# EAGLE design trackoon solar (EAGLE 7.2.0)
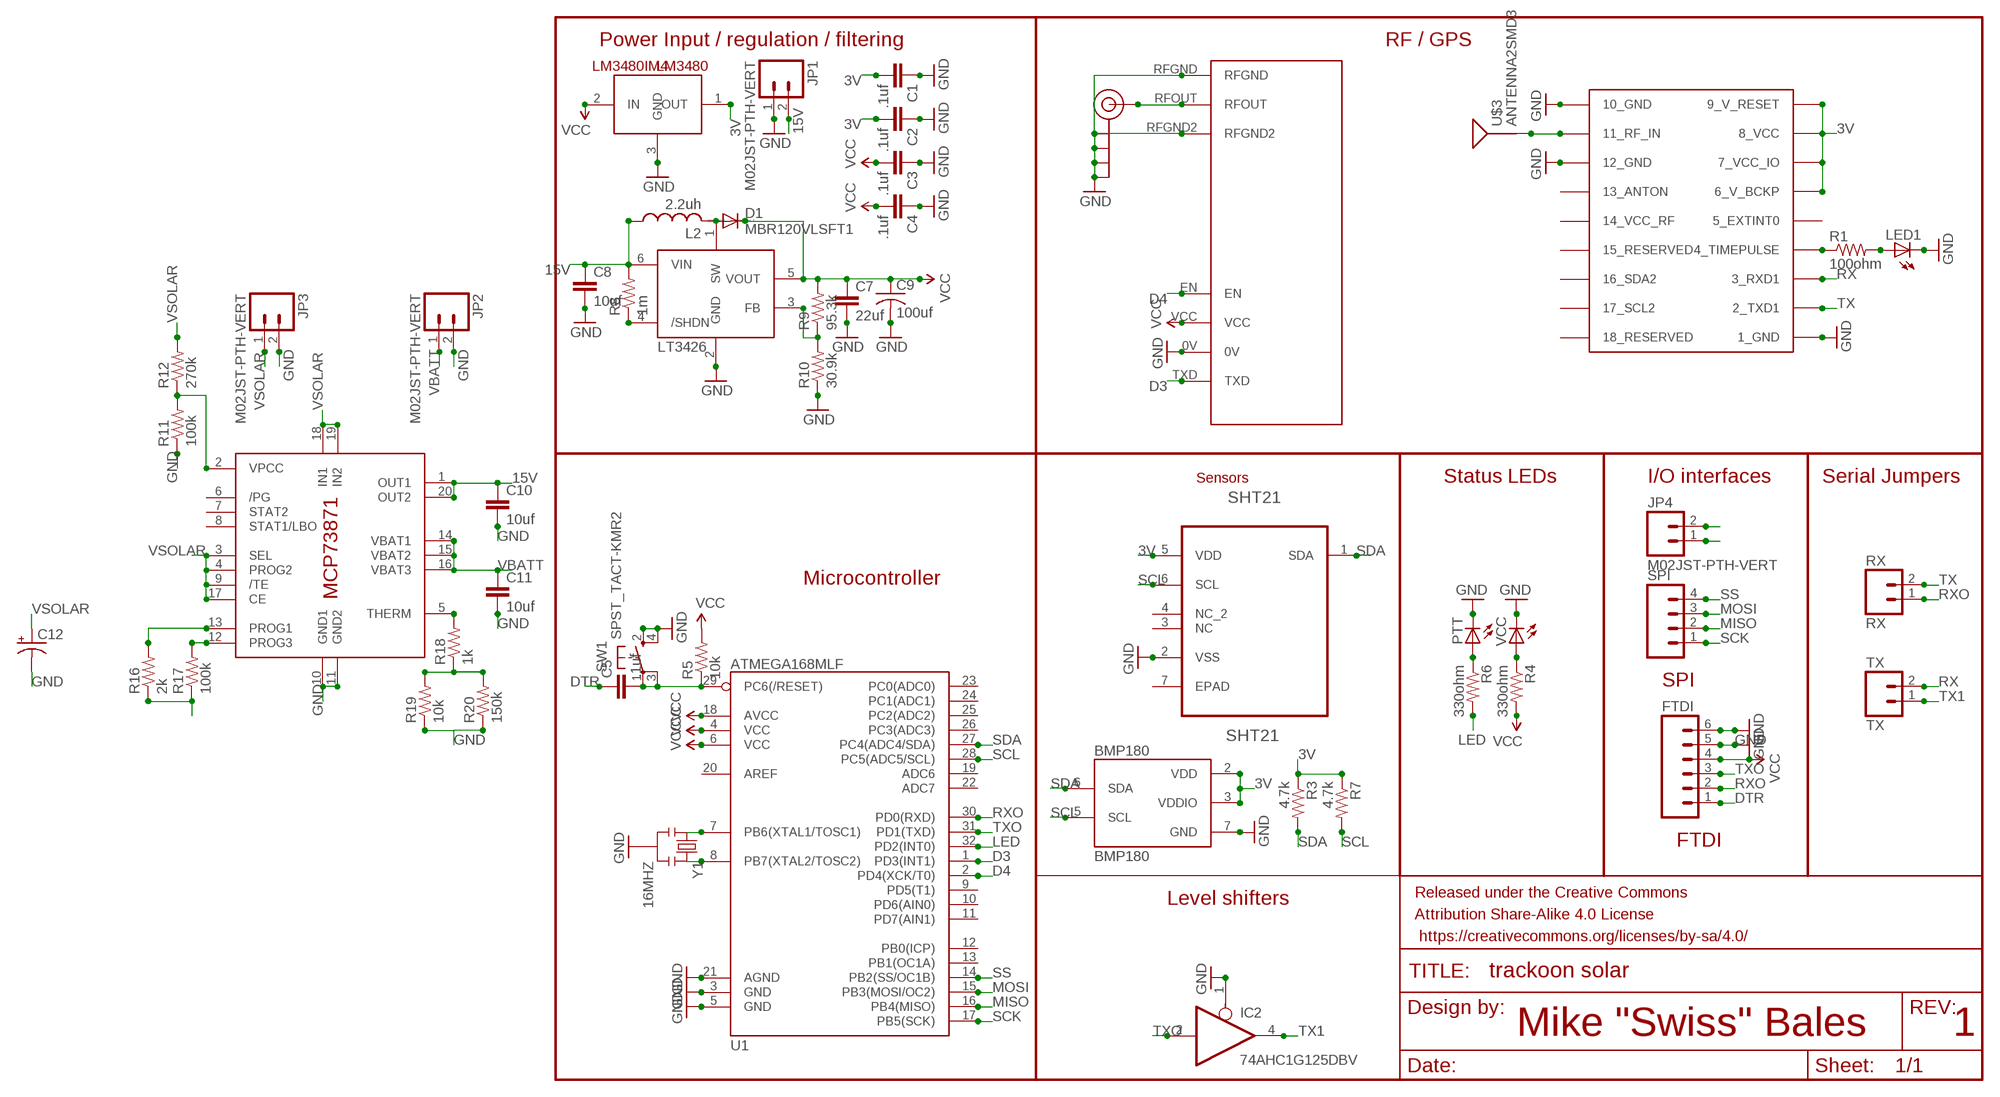
[diagram p0: schematic, sheet 1]

## Parts
BMP180  BMP180  [BMP180]
C1  .1uf  CAP0805  [0805]
C2  .1uf  CAP0805  [0805]
C3  .1uf  CAP0805  [0805]
C4  .1uf  CAP0805  [0805]
C5  .1uf  CAP0805  [0805]
C7  22uf  CAP0805  [0805]
C8  10uf  CAP0805  [0805]
C9  100uf  C-USC1206  [C1206]
C10  10uf  CAP0805  [0805]
C11  10uf  CAP0805  [0805]
C12  CPOL-US153CLV-1012  [153CLV-1012]
D1  MBR120VLSFT1  DIODE-SOD123  [SOD123]
FRAME1  FRAME-LETTER  [CREATIVE_COMMONS]
FTDI  M06NO_SILK_FEMALE_PTH  [1X06_NO_SILK]
IC1  MCP73871  [QFN20]
IC2  74AHC1G125DBV  [SOT23-5]
J$1  SMA_EDGE  [SMA-EDGE]
JP1  M02JST-PTH-VERT  [JST-2-PTH-VERT]
JP2  M02JST-PTH-VERT  [JST-2-PTH-VERT]
JP3  M02JST-PTH-VERT  [JST-2-PTH-VERT]
JP4  M02JST-PTH-VERT  [JST-2-PTH-VERT]
L2  2.2uh  L-USL1812  [L1812]
LED1  LEDCHIP-LED0805  [CHIP-LED0805]
LM3480  LM3480IM4  [SOT23-3]
LT3426  LT3426  [SOT23-6]
PTT  LEDCHIP-LED0805  [CHIP-LED0805]
R1  100ohm  RESISTOR0805-RES  [0805]
R3  4.7k  RESISTOR0805-RES  [0805]
R4  330ohm  RESISTOR0805-RES  [0805]
R5  10k  RESISTOR0805-RES  [0805]
R6  330ohm  RESISTOR0805-RES  [0805]
R7  4.7k  RESISTOR0805-RES  [0805]
R8  1m  RESISTOR0805-RES  [0805]
R9  95.3k  RESISTOR0805-RES  [0805]
R10  30.9k  RESISTOR0805-RES  [0805]
R11  100k  RESISTOR0805-RES  [0805]
R12  270k  RESISTOR0805-RES  [0805]
R16  2k  RESISTOR0805-RES  [0805]
R17  100k  RESISTOR0805-RES  [0805]
R18  1k  RESISTOR0805-RES  [0805]
R19  10k  RESISTOR0805-RES  [0805]
R20  150k  RESISTOR0805-RES  [0805]
RX  RX  M02PTH  [1X02]
SHT21  SHT21  [DFN300X300X110-7N]
SPI  M04JST-PTH-VERT  [JST-4-PTH-VERT]
SW1  SPST_TACT-KMR2  [KMR2]
TX  TX  M02PTH  [1X02]
U1  ATMEGA168MLF  [MLF32]
U$1  UBLOX_MAX  [UBLOX_MAX]
U$2  RADIOMETRIX-HX1  [RADIOMETRIX-HX1]
U$3  ANTENNA2SMD3  [ANTENNA-CHIP4]
VCC  LEDCHIP-LED0805  [CHIP-LED0805]
Y1  16MHZ  RESONATOR16MHZ  [RESONATOR-SMD]

## Nets
3V: BMP180.2(VDD) BMP180.3(VDDIO) C1.2 C2.2 LM3480.1(OUT) R3.1 R7.1 SHT21.5(VDD) U$1.6_V_BCKP U$1.7_VCC_IO U$1.8_VCC U$1.9_V_RESET
15V: C8.1 C10.1 IC1.1(OUT1) IC1.20(OUT2) JP1.2 L2.1 LT3426.6(VIN) R8.2
D3: U1.1(PD3(INT1)) U$2.TXD
D4: U1.2(PD4(XCK/T0)) U$2.EN
DTR: C5.1 FTDI.1
GND: BMP180.7(GND) C1.1 C2.1 C3.1 C4.1 C7.2 C8.2 C9.2 C10.2 C11.2 C12.- FTDI.5 FTDI.6 IC1.10(GND1) IC1.11(GND2) IC2.1(OE) J$1.GND@0(GND) J$1.GND@1(GND) J$1.GND@2(GND) J$1.GND@3(GND) JP1.1 JP2.2 JP3.2 LED1.C LM3480.3(GND) LT3426.2(GND) PTT.C R10.1 R11.1 R16.1 R17.1 R19.1 R20.1 SHT21.2(VSS) SW1.2(S) SW1.4(S1) U1.3(GND) U1.5(GND) U1.21(AGND) U$1.1_GND U$1.10_GND U$1.12_GND U$2.0V U$2.RFGND U$2.RFGND2 VCC.C Y1.2
LED: R6.2 U1.32(PD2(INT0))
MISO: SPI.2 U1.16(PB4(MISO))
MOSI: SPI.3 U1.15(PB3(MOSI/OC2))
N$1: J$1.SIG(SIGNAL) U$2.RFOUT
N$2: R1.1 U$1.4_TIMEPULSE
N$3: LED1.A R1.2
N$6: U$1.11_RF_IN U$3.SIG(SIGNAL)
N$8: R4.1 VCC.A
N$9: D1.A L2.2 LT3426.1(SW)
N$12: LT3426.4(/SHDN) R8.1
N$13: LT3426.3(FB) R9.1 R10.2
N$14: U1.8(PB7(XTAL2/TOSC2)) Y1.3
N$17: IC1.2(VPCC) R11.2 R12.1
N$19: C5.2 R5.1 SW1.1(P) SW1.3(P1) U1.29(PC6(/RESET))
N$23: IC1.13(PROG1) R16.2
N$25: IC1.12(PROG3) R17.2
N$26: U1.7(PB6(XTAL1/TOSC1)) Y1.1
N$27: PTT.A R6.1
N$29: IC1.5(THERM) R18.2
N$30: R18.1 R19.2 R20.2
RX: TX.2 U$1.3_RXD1
RXO: FTDI.2 RX.1 U1.30(PD0(RXD))
SCK: SPI.1 U1.17(PB5(SCK))
SCL: BMP180.5(SCL) JP4.1 R7.2 SHT21.6(SCL) U1.28(PC5(ADC5/SCL))
SDA: BMP180.6(SDA) JP4.2 R3.2 SHT21.1(SDA) U1.27(PC4(ADC4/SDA))
SS: SPI.4 U1.14(PB2(SS/OC1B))
TX: RX.2 U$1.2_TXD1
TX1: IC2.4(O) TX.1
TXO: FTDI.3 IC2.2(I) U1.31(PD1(TXD))
VBATT: C11.1 IC1.14(VBAT1) IC1.15(VBAT2) IC1.16(VBAT3) JP2.1
VCC: C3.2 C4.2 C7.1 C9.1 D1.C FTDI.4 LM3480.2(IN) LT3426.5(VOUT) R4.2 R5.2 R9.2 U1.4(VCC) U1.6(VCC) U1.18(AVCC) U$2.VCC
VSOLAR: C12.+ IC1.3(SEL) IC1.4(PROG2) IC1.9(/TE) IC1.17(CE) IC1.18(IN1) IC1.19(IN2) JP3.1 R12.2
Unconnected: IC1.6(/PG) IC1.7(STAT2) IC1.8(STAT1/LBO) SHT21.3(NC) SHT21.4(NC_2) SHT21.7(EPAD) U1.9(PD5(T1)) U1.10(PD6(AIN0)) U1.11(PD7(AIN1)) U1.12(PB0(ICP)) U1.13(PB1(OC1A)) U1.19(ADC6) U1.20(AREF) U1.22(ADC7) U1.23(PC0(ADC0)) U1.24(PC1(ADC1)) U1.25(PC2(ADC2)) U1.26(PC3(ADC3)) U$1.5_EXTINT0 U$1.13_ANTON U$1.14_VCC_RF U$1.15_RESERVED U$1.16_SDA2 U$1.17_SCL2 U$1.18_RESERVED

## Notes on the sheet
- Power Input / regulation / filtering | RF / GPS
- Sensors | Status LEDs | I/O interfaces | Serial Jumpers
- Microcontroller
- SPI
- FTDI
- Level shifters
- Mike "Swiss" Bales | 1

## Power pins joined to a net without a drawn wire
GND: IC2.3(GND)
VCC: IC2.5(VCC)

## Library data of the parts
BMP180 = SparkFun-Sensors:BMP180: BOSCH BMP180 DIGITAL BAROMETRIC PRESSURE SENSOR Web page: http://www.bosch-sensortec.com/en/homepage/products_3/environmental_sensors_1/bmp180_1/bmp180 Datasheet: http://ae-bst.resource.bosch.com/media/products/dokumente/bmp180/BST-BMP180-DS000-09.pdf The BMP180 is the function compatible successor of the BMP085, a new generation of high precision digital pressure sensors for consumer applications. The ultra-low power, low voltage electronics of the BMP180 is optimized for use in mobile phones, PDAs, GPS navigation devices and outdoor equipment. With a low altitude noise of merely 0.25m at fast conversion time, the BMP180 offers superior performance. The I2C interface allows for easy system integration with a microcontroller. The BMP180 is based on piezo-resistive technology for EMC robustness, high accuracy and linearity as well as long term stability. Key features: - Temperature measurement included - I2C interface - Fully calibrated - Pb-free, halogen-free and RoHS compliant, - MSL 1 Basic specs: Pressure range: 300 to 1100hPa (+9000m to -500m relating to sea level) Supply voltage: 1.8 to 3.6V (VDD), 1.62V to 3.6V (VDDIO) Package: LGA package with metal lid Small footprint: 3.6mm x 3.8mm Super-flat: 0.93mm height Low power: 5μA at 1 sample / sec. in standard mode Low noise: 0.06hPa (0.5m) in ultra low power mode, 0.02hPa (0.17m) advanced resolution mode Typical applications: - Enhancement of GPS navigation (dead-reckoning, slope detection, etc.) - In- and out-door navigation - Leisure and sports - Weather forecast - Vertical velocity indication (rise/sink speed)
C1-C5 C7 C8 C10 C11 = SparkFun-Capacitors:CAP: Capacitor Standard 0603 ceramic capacitor, and 0.1" leaded capacitor.
C9 = resistor:C-US: CAPACITOR, American symbol
C12 = adafruit:CPOL-US: POLARIZED CAPACITOR, American symbol
D1 = diode:DIODE-: DIODE
FRAME1 = SparkFun-Aesthetics:FRAME-LETTER: Schematic Frame Standard 8.5x11 US Letter frame
FTDI = SparkFun-Connectors:M06: Header 6 Standard 6-pin 0.1" header. Use with straight break away headers (SKU : PRT-00116), right angle break away headers (PRT-00553), swiss pins (PRT-00743), machine pins (PRT-00117), and female headers (PRT-00115). Molex polarized connector foot print use with SKU : PRT-08094 with associated crimp pins and housings. NOTES ON THE VARIANTS LOCK and LOCK_LONGPADS... This footprint was designed to help hold the alignment of a through-hole component (i.e. 6-pin header) while soldering it into place. You may notice that each hole has been shifted either up or down by 0.005 of an inch from it's more standard position (which is a perfectly straight line). This slight alteration caused the pins (the squares in the middle) to touch the edges of the holes. Because they are alternating, it causes a "brace" to hold the component in place. 0.005 has proven to be the perfect amount of "off-center" position when using our standard breakaway headers. Although looks a little odd when you look at the bare footprint, once you have a header in there, the alteration is very hard to notice. Also,if you push a header all the way into place, it is covered up entirely on the bottom side. This idea of altering the position of holes to aid alignment will be further integrated into the Sparkfun Library for other footprints. It can help hold any component with 3 or more connection pins.; PROD_ID: CONN-08437
IC1 = adafruit:MCP73871
IC2 = 74xx-little-us:74*1G125: Single Bus Buffer Gate with 3-State Output
J$1 = SparkFun-Connectors:SMA_EDGE: SMA Antenna Connector End launch SMA connector. The paste layer has been removed so that the connector can be hand soldered onto the board after reflow.
JP1-JP4 RX TX = SparkFun-Connectors:M02: Standard 2-pin 0.1" header. Use with - straight break away headers ( PRT-00116) - right angle break away headers (PRT-00553) - swiss pins (PRT-00743) - machine pins (PRT-00117) - female headers (PRT-00115) Molex polarized connector foot print use with: PRT-08233 with associated crimp pins and housings. 2.54_SCREWTERM for use with PRT-10571. 3.5mm Screw Terminal footprints for PRT-08084 5mm Screw Terminal footprints for use with PRT-08432
L2 = resistor:L-US: INDUCTOR, American symbol
LED1 PTT VCC = adafruit:LED: LED OSRAM: - CHIPLED LG R971, LG N971, LY N971, LG Q971, LY Q971, LO R971, LY R971 LH N974, LH R974 LS Q976, LO Q976, LY Q976 LO Q996 - Hyper CHIPLED LW Q18S LB Q993, LB Q99A, LB R99A - SideLED LS A670, LO A670, LY A670, LG A670, LP A670 LB A673, LV A673, LT A673, LW A673 LH A674 LY A675 LS A676, LA A676, LO A676, LY A676, LW A676 LS A679, LY A679, LG A679 - Hyper Micro SIDELED® LS Y876, LA Y876, LO Y876, LY Y876 LT Y87S - SmartLED LW L88C, LW L88S LB L89C, LB L89S, LG L890 LS L89K, LO L89K, LY L89K LS L896, LA L896, LO L896, LY L896 - TOPLED LS T670, LO T670, LY T670, LG T670, LP T670 LSG T670, LSP T670, LSY T670, LOP T670, LYG T670 LG T671, LOG T671, LSG T671 LB T673, LV T673, LT T673, LW T673 LH T674 LS T676, LA T676, LO T676, LY T676, LB T676, LH T676, LSB T676, LW T676 LB T67C, LV T67C, LT T67C, LS T67K, LO T67K, LY T67K, LW E67C LS E67B, LA E67B, LO E67B, LY E67B, LB E67C, LV E67C, LT E67C LW T67C LS T679, LY T679, LG T679 LS T770, LO T770, LY T770, LG T770, LP T770 LB T773, LV T773, LT T773, LW T773 LH T774 LS E675, LA E675, LY E675, LS T675 LS T776, LA T776, LO T776, LY T776, LB T776 LHGB T686 LT T68C, LB T68C - Hyper Mini TOPLED® LB M676 - Mini TOPLED Santana® LG M470 LS M47K, LO M47K, LY M47K Source: http://www.osram.convergy.de/
LM3480 = SparkFun-PowerIC:LM3480IM4: Small package linear regulator
LT3426 = adafruit:LT3426: LT3426 1.2MHz, 2A boost converter in SOT-23 http://www.linear.com/pc/productDetail.jsp?navId=H0,C1,C1003,C1042,C1031,C1061,P8430 (Linear website)
R1 R3-R12 R16-R20 = SparkFun-Resistors:RESISTOR: Resistor Basic schematic elements and footprints for 0603, 1206, and PTH resistors.
SHT21 = sht21:SHT21: SENSOR, HUMIDITY & TEMP; MPN: SHT21; OC_FARNELL: 1855468; OC_NEWARK: 20T1172; PACKAGE: DFN-6; SUPPLIER: SENSIRION
SPI = SparkFun-Connectors:M04: Header 4 Standard 4-pin 0.1" header. Use with straight break away headers (SKU : PRT-00116), right angle break away headers (PRT-00553), swiss pins (PRT-00743), machine pins (PRT-00117), and female headers (PRT-00115). Molex polarized connector foot print use with SKU : PRT-08231 with associated crimp pins and housings. 1MM SMD Version SKU: PRT-10208
SW1 = adafruit:SPST_TACT: SMT 6mm switch, EVQQ2 series http://www.ladyada.net/library/eagle
U1 = SparkFun-DigitalIC:ATMEGA168: Atmel 32-pin 8-bit micro, 16k flash.
U$1 = Ava:UBLOX_MAX: UBLOX MAX
U$2 = Ava:RADIOMETRIX-HX1
U$3 = SparkFun-RF:ANTENNA2: Chip antenna Single endded antenna. Common with smaller chip antennas. CHIP4 package is the GPS Chip Antenna SKU: GPS-08418. CHIP5 package is 2.4GHz chip antenna SKU: WRL-00144.
Y1 = SparkFun-FreqCtrl:RESONATOR: Resonator Small SMD resonator. Used, eg, on the Arduino Pro/ Pro Mini boards. 8MHz- XTAL-08895 16MHz- XTAL-08900; PROD_ID: XTAL-08900

## Board
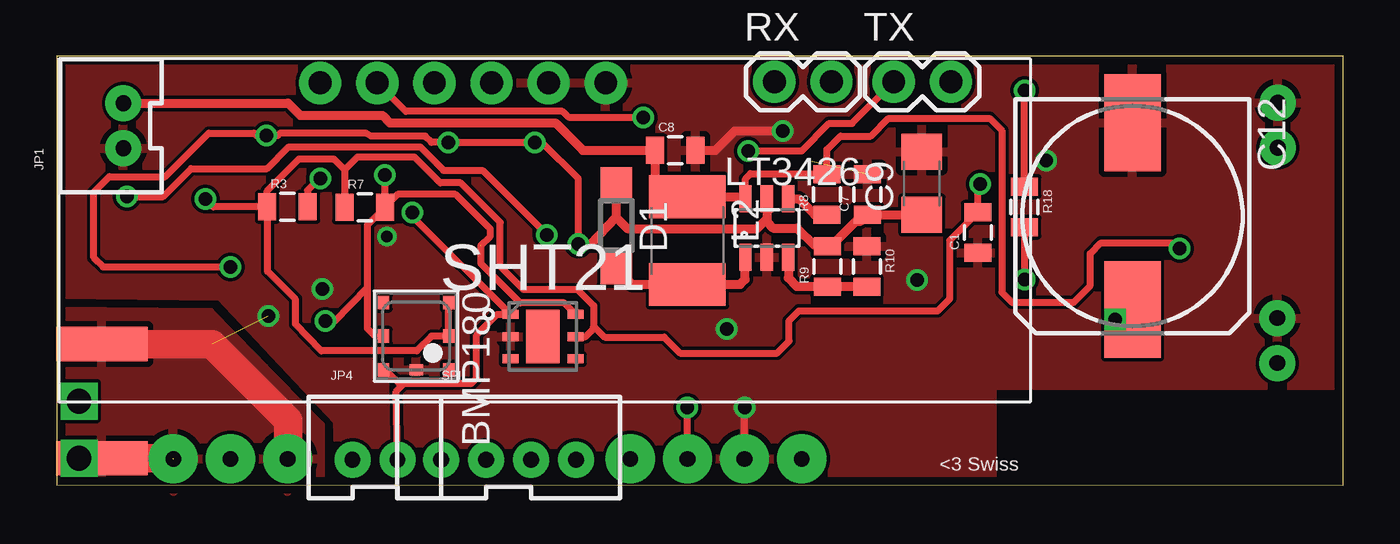
[diagram p1: board, top side]
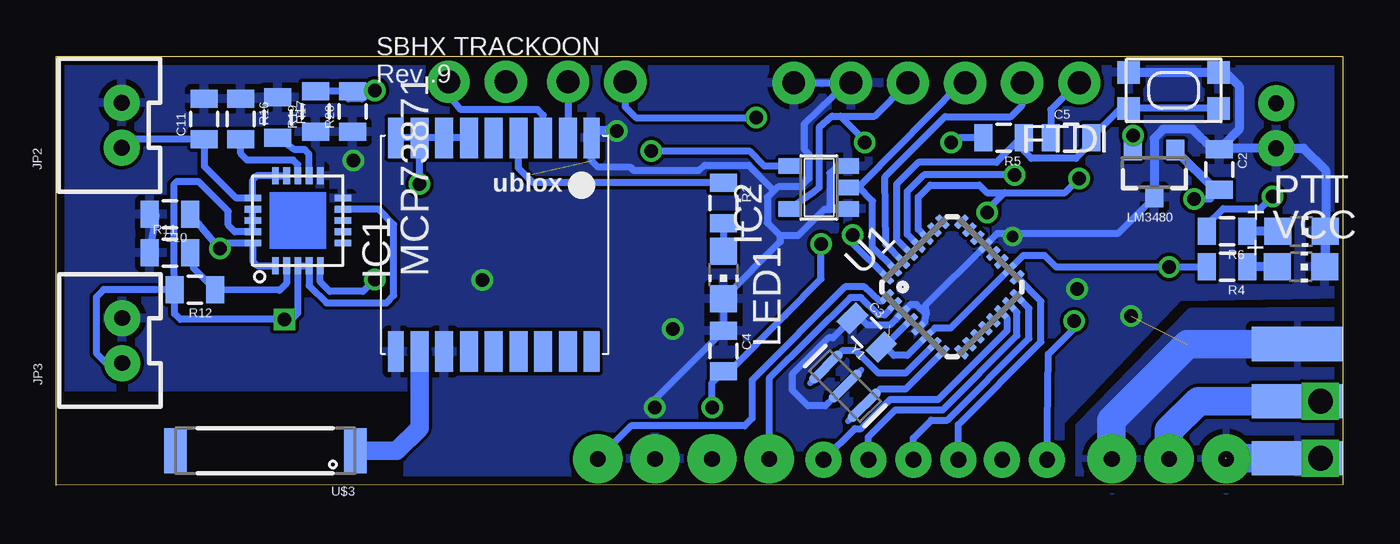
[diagram p2: board, bottom side, seen from below]

Size 57.2 x 19.07 mm. Coordinates in mm from the lower left corner, seen from the top.
Outline: 0,0.03 57.2,0 57.2,19.07 0,19.07 0,0.03
Copper layers (1*16): Top 0.0356mm / dielectric 1.5011mm / Bottom 0.0356mm
Design rules "oshpark-2layer": minimum track width 6mil, minimum drill 13mil, track to track 6mil, track to pad 6mil, pad to pad 6mil, via to via 6mil, smd to smd 6mil, copper to edge 15mil, drill to drill 6mil, minimum pad ring 7mil, minimum via ring 7mil, stop-mask expansion 4mil, vias tented up to drill 0mil, thermal gap 10mil

### Footprints (pad centres in the part's own frame; a part is rotated, then mirrored left to right if it is on the bottom)
BMP180 = smd 0.6 x 0.5: 1 1.5,1.45; 2 0,1.45; 3 -1.5,1.45; 4 -1.5,-1.45; 5 0,-1.45; 6 1.5,-1.45 | smd 0.5 x 0.6: 7 1.5,0
0805 = smd 0.8 x 1.2: 1 -0.9,0; 2 0.9,0
C1206 = smd 1.6 x 1.8: 1 -1.4,0; 2 1.4,0
153CLV-1012 = smd 4.3 x 2.5: + 4.15,0; - -4.15,0
SOD123 = smd 1.4 x 1.4: A 1.9,0; C -1.9,0
1X06_NO_SILK = drill 1.016 pad 1.88: 1 0,0; 2 2.54,0; 3 5.08,0; 4 7.62,0; 5 10.16,0; 6 12.7,0
QFN20 = smd 0.75 x 0.3: 1 -2,1; 2 -2,0.5; 3 -2,0; 4 -2,-0.5; 5 -2,-1; 11 2,-1; 12 2,-0.5; 13 2,0; 14 2,0.5; 15 2,1 | smd 0.3 x 0.75: 6 -1,-2; 7 -0.5,-2; 8 0,-2; 9 0.5,-2; 10 1,-2; 16 1,2; 17 0.5,2; 18 0,2; 19 -0.5,2; 20 -1,2
SOT23-5 = smd 0.69 x 0.99: 1 -0.95,-1.29; 2 0,-1.29; 3 0.95,-1.29; 4 0.95,1.3; 5 -0.95,1.3
SMA-EDGE = smd 1.524 x 4.064: GND@0 0,0; GND@1 5.08,0; SIG 2.54,0 | smd 1.524 x 4.064 bottom: GND@2 0,0; GND@3 5.08,0
JST-2-PTH-VERT = drill 0.7 pad 1.6: 1 -1,-0.55; 2 1,-0.55
L1812 = smd 1.9 x 3.4: 1 -1.95,0; 2 1.95,0
CHIP-LED0805 = smd 1.2 x 1.2: A 0,-1.05; C 0,1.05
SOT23-3 = smd 0.8 x 0.9: 1 -0.95,-1; 2 0.95,-1; 3 0,1.1
SOT23-6 = smd 0.55 x 1.2: 1 -0.95,-1.3; 2 0,-1.3; 3 0.95,-1.3; 4 0.95,1.3; 5 0,1.3; 6 -0.95,1.3
1X02 = drill 1.016 pad 1.88: 1 0,0; 2 2.54,0
DFN300X300X110-7N = smd 0.711 x 0.406: 1 -1.448,0.991; 2 -1.448,0; 3 -1.448,-0.991; 4 1.448,-0.991; 5 1.448,0; 6 1.448,0.991 | smd 1.499 x 2.388: 7 0,0
JST-4-PTH-VERT = drill 0.7 pad 1.6: 1 -3,-0.55; 2 -1,-0.55; 3 1,-0.55; 4 3,-0.55
KMR2 = smd 1 x 1: 1 2,0.8; 2 2,-0.8; 3 -2,0.8; 4 -2,-0.8
MLF32 = smd 0.7 x 0.3: 1 -2.35,1.75; 2 -2.35,1.25; 3 -2.35,0.75; 4 -2.35,0.25; 5 -2.35,-0.25; 6 -2.35,-0.75; 7 -2.35,-1.25; 8 -2.35,-1.75; 17 2.35,-1.75; 18 2.35,-1.25; 19 2.35,-0.75; 20 2.35,-0.25; 21 2.35,0.25; 22 2.35,0.75; 23 2.35,1.25; 24 2.35,1.75 | smd 0.3 x 0.7: 9 -1.75,-2.35; 10 -1.25,-2.35; 11 -0.75,-2.35; 12 -0.25,-2.35; 13 0.25,-2.35; 14 0.75,-2.35; 15 1.25,-2.35; 16 1.75,-2.35; 25 1.75,2.35; 26 1.25,2.35; 27 0.75,2.35; 28 0.25,2.35; 29 -0.25,2.35; 30 -0.75,2.35; 31 -1.25,2.35; 32 -1.75,2.35
UBLOX_MAX = smd 1.8 x 0.7: 1_GND 4.95,-4.4; 9_V_RESET 4.95,4.3; 10_GND -4.55,4.3; 18_RESERVED -4.55,-4.4 | smd 1.8 x 0.8: 2_TXD1 4.95,-3.35; 3_RXD1 4.95,-2.25; 4_TIMEPULSE 4.95,-1.15; 5_EXTINT0 4.95,-0.05; 6_V_BCKP 4.95,1.05; 7_VCC_IO 4.95,2.15; 8_VCC 4.95,3.25; 11_RF_IN -4.55,3.25; 12_GND -4.55,2.15; 13_ANTON -4.55,1.05; 14_VCC_RF -4.55,-0.05; 15_RESERVED -4.55,-1.15; 16_SDA2 -4.55,-2.25; 17_SCL2 -4.55,-3.35
RADIOMETRIX-HX1 = drill 0.7 pad 2.184: 0V 8.89,-10.16; EN 3.81,-10.16; RFGND -11.43,-10.16; RFGND2 -16.51,-10.16; RFOUT -13.97,-10.16; TXD 11.43,-10.16; VCC 6.35,-10.16
ANTENNA-CHIP4 = smd 1 x 2: NC 4,0; SIG -4,0
RESONATOR-SMD = smd 0.45 x 1.905: 1 -1.2,0; 2 0,0; 3 1.2,0

### Placement (x,y rotation side)
BMP180  15.98,6.63 270 top
C1  40.94,11.23 90 top
C2  5.49,14.02 270 bottom
C3  21.16,6.78 315 bottom
C4  27.53,5.97 270 bottom
C5  12.07,15.45 0 bottom
C7  36.04,12.93 90 top
C8  27.51,14.88 0 top
C9  38.46,13.41 90 top
C10  52.15,12.04 180 bottom
C11  50.62,16.28 90 bottom
C12  47.83,11.96 270 top
D1  24.87,11.53 270 top
FRAME1  14.38,-8.13 0 top  (outside the outline)
FTDI  11.71,17.88 180 bottom
IC1  46.46,11.76 90 bottom
IC2  23.29,13.23 90 bottom
J$1  2.01,1.19 90 bottom
JP1  2.41,15.98 90 top
JP2  54.84,16 90 bottom
JP3  54.81,6.43 90 bottom
JP4  14.15,1.68 0 top
L2  28.04,10.87 270 top
LED1  27.53,9.35 180 bottom
LM3480  8.38,13.89 180 bottom
LT3426  31.57,11.43 0 top
PTT  1.83,11.28 270 bottom
R1  27.53,12.55 270 bottom
R3  10.26,12.37 0 top
R4  5.13,9.7 180 bottom
R5  15.08,15.43 180 bottom
R6  5.13,11.28 180 bottom
R7  13.69,12.34 0 top
R8  34.24,12.93 90 top
R9  34.26,9.73 90 top
R10  36.02,9.73 270 top
R11  52.15,10.34 0 bottom
R12  51.03,8.69 180 bottom
R16  49,16.28 270 bottom
R17  47.35,16.33 270 bottom
R18  43.03,12.37 270 top
R19  45.67,16.61 90 bottom
R20  44.02,16.61 90 bottom
RX  31.9,17.93 0 top
SHT21  21.62,6.6 0 top
SPI  20.09,1.68 0 top
SW1  7.52,17.55 180 bottom
TX  37.21,17.93 0 top
U1  17.37,8.81 45 bottom
U$1  37.8,10.49 90 bottom
U$2  21.69,11.33 0 top
U$3  47.9,1.52 180 bottom
VCC  1.85,9.7 270 bottom
Y1  22.13,4.4 315 bottom

### Tracks (layer width: path | path; a pad name or v marks a point on that pad's centre or on a via)
3V  (via drill 0.6)
  Top 0.305: R3.1 6.96,12.37 v6.6,12.73 | R3.1 9.36,13.1 10.77,14.5 12.32,14.5 12.8,14.02 | 12.8,14.02 12.8,12.36 R7.1 12.79,12.23 | 12.8,14.02 13.36,14.58 15.9,14.58 17.04,13.44 17.96,13.44 19.71,11.68 19.71,9.73 20.75,8.69 23.16,8.69 23.88,7.98 23.88,7.06 | R3.1 9.37,12.36 9.37,9.5 10.62,8.26 10.62,7.16 11.76,5.97 16,5.97 16.66,6.63 BMP180.2 BMP180.3 | SHT21.5 23.52,6.6 23.88,6.96 23.88,7.06 | 23.88,7.06 24.36,6.58 27,6.58 27.71,5.87 32.03,5.87 32.56,6.4 32.56,7.32 32.99,7.75 39.17,7.75 39.7,8.28 39.7,10.88 C1.2 40.95,13.23 v41.05,13.39
  Bottom 0.305: U$1.6_V_BCKP U$1.7_VCC_IO U$1.8_VCC | U$1.8_VCC U$1.9_V_RESET | v6.6,12.73 5.88,12.73 C2.2 | v41.05,13.39 U$1.8_VCC
  Bottom 0.406: C2.2 5.66,13.12 LM3480.1
15V  (via drill 0.6)
  Top 0.305: LT3426.6 30.62,13.63 30.84,13.84 34.23,13.84 R8.2 34.24,14.91 34.85,15.52 36.2,15.52 36.98,16.31 41.48,16.31 42.01,15.77 42.01,8.59 42.47,8.13 45.21,8.13 45.95,8.86 45.95,10.29 46.43,10.77 49.82,10.77 v49.93,10.52
  Top 0.406: JP1.2 10.28,16.98 10.82,16.43 14.48,16.43 14.81,16.1 22.17,16.1 23.39,14.88 C8.1 26.61,13.55 27.36,12.8 28.02,12.8 L2.1 30.53,12.82 LT3426.6
  Bottom 0.305: IC1.1 48.26,9.75 48.46,9.95 IC1.20 49.81,10.76 v49.93,10.52 50.19,10.78 C10.1
D3
  Bottom 0.305: U1.1 20.48,8.18 20.57,8.18 21.26,8.81 22.12,8.81 26.26,4.67 26.26,2.97 26.59,2.64 31.65,2.64 U$2.TXD
D4
  Bottom 0.305: U1.2 20.36,7.57 20.65,7.57 21.41,8.33 21.89,8.33 25.5,4.75 U$2.EN
DTR
  Bottom 0.305: FTDI.1 11.79,17.88 12.98,16.69 C5.1
GND  (via drill 0.5, 0.6, 1.1)  (4 unrouted)
  Top 0.305: U$2.0V v30.58,3.45
  Top 0.406: C8.2 29.29,14.88 30.15,15.75 v32.28,15.75
  Top 1.27: J$1.GND@1 6.91,6.27 10.29,2.9 10.29,1.19 U$2.RFGND | 1.91,1.19 5.21,1.19
  Bottom 0.305: U1.5 18.57,7.27 18.52,7.59 | 18.52,7.59 18.95,8.03 19.22,8.03 U1.3 20.14,7.11 21.13,7.11 21.44,7.42 C3.1 22.66,6.55 22.86,6.55 24.49,4.93 24.49,4.24 23.77,3.53 23,3.53 22.84,3.69 | 18.52,7.59 18.57,7.97 U1.21 15.37,11.18 10,11.18 LM3480.3 | FTDI.6 22.05,17.88 | FTDI.5 22.05,17.88 | 22.05,17.88 23.95,16.05 23.95,14.94 23.72,14.71 23.72,13.64 24.11,13.26 25.12,13.26 25.3,13.08 | 25.3,13.08 25.58,12.8 25.58,11.66 25.02,11.1 | 25.02,11.1 24.21,11.1 23.04,12.27 22.55,12.27 | 22.55,12.27 22.02,12.27 IC2.1 | IC2.3 22.44,14.18 22.81,13.87 22.81,12.47 22.55,12.27 | 25.02,11.1 25.02,10.81 LED1.C C4.1 30.58,3.82 v30.58,3.45 | U$1.1_GND 33.4,14.42 33.12,14.15 31.67,14.15 31.52,14 28.63,14 28.37,14.22 26.42,14.22 25.3,13.08 | R11.1 52.74,12.01 C10.2
  Bottom 0.406: SW1.2 SW1.4 5.22,18.35 4.6,17.73 4.6,15.81 C2.1 | VCC.C 0.78,9.73 PTT.C 0.76,11.29 0.76,14 1.74,14.98 JP1.1 5.43,14.98 C2.1 | C2.1 5.78,14.92 6.68,15.82 7.98,15.82 8.38,15.42 LM3480.3 | v32.28,15.75 33.19,15.75 U$1.1_GND
  Bottom 1.27: U$2.RFGND2 5.16,1.19 J$1.GND@2 | J$1.GND@1 6.91,6.27 10.29,2.9 10.29,1.19 U$2.RFGND
  other vias: 29.79,6.93 9.4,7.52 14.68,11.05 11.81,8.71 0.99,1.19 43.99,14.43 38.25,9.12
  pour Top: -0.13,19.08 57.4,19.23 57.43,4.42 41.58,4.42 41.58,-0.3 12.6,-0.46 12.5,2.84 7.29,8.38 -0.1,8.46
  pour Bottom: -0.15,19.08 57.38,19.2 57.43,4.37 41.58,4.37 41.58,-0.33 12.7,-0.46 12.55,-0.3 12.55,2.82 7.29,8.38 -0.2,8.51
  pour Top: -0.1,7.75 6.81,7.7 11.71,2.67 11.71,-0.46 -0.1,-0.33
  pour Bottom: -0.1,7.77 6.78,7.72 11.76,2.62 11.76,-0.43 0,-0.41
LED  (via drill 0.6)
  Top 0.305: v3.12,12.83 4.72,12.83 5.97,14.07 9.35,14.07 10.31,15.04 16.15,15.04 17.2,14 18.92,14 v21.79,11.13
  Bottom 0.305: R6.2 6.03,11.57 5.31,12.29 3.66,12.29 v3.12,12.83 | v21.79,11.13 21.79,10.76 U1.32
MISO
  Bottom 0.305: SPI.2 19.09,2.09 18.29,2.9 17.58,2.9 13.95,6.53 13.95,7.86 U1.16
MOSI
  Bottom 0.305: SPI.3 21.09,2.15 19.89,3.35 17.78,3.35 14.48,6.65 14.48,7.69 U1.15
N$1
  Bottom 1.27: J$1.SIG 6.43,3.73 7.72,2.44 U$2.RFOUT
N$2
  Bottom 0.305: R1.1 36,13.45 36.65,14.1 36.65,15.53 U$1.4_TIMEPULSE
N$3
  Bottom 0.305: R1.2 LED1.A
N$6
  Bottom 0.813: U$1.11_RF_IN 41.05,2.54 42.06,1.52 U$3.SIG
N$8
  Bottom 0.406: VCC.A R4.1
N$9
  Top 0.406: LT3426.1 30.61,10.11 30.61,9.14 30.38,8.92 L2.2 25.58,8.92 D1.A
N$12
  Top 0.406: LT3426.4 32.99,12.73 33.71,12.01 34.23,12.01 R8.1
N$13
  Top 0.406: R10.2 R9.1 34.25,8.84 32.89,8.84 32.52,9.21 LT3426.3
N$14
  Bottom 0.305: U1.8 19.44,4.27 20.56,4.27
N$17
  Bottom 0.305: IC1.2 46.96,8.97 47.27,8.66 R12.1 51.09,9.65 R11.2
N$18  (via drill 1.1)
  other vias: 0.99,3.73
N$19
  Bottom 0.305: SW1.3 SW1.1 9.87,16.75 C5.2 11.17,15.22 11.86,14.53 13.84,14.53 14.17,14.86 R5.1 14.31,15.43 15.39,14.35 18.87,14.35 19.84,13.39 19.84,10.92 U1.29
N$23
  Bottom 0.305: IC1.13 46.46,14.25 46.66,14.45 48.72,14.45 49,14.73 R16.2
N$25
  Bottom 0.305: IC1.12 45.96,14.71 46.15,14.91 46.59,14.91 R17.2
N$26
  Bottom 0.305: U1.7 19.44,4.98 20.65,4.98 21.64,5.97 22.26,5.97
N$27
  Bottom 0.406: PTT.A R6.1
N$29  (via drill 0.6)
  Top 0.305: R18.2 v43.03,9.14
  Bottom 0.305: v43.03,9.14 43.56,8.61 45.03,8.61 45.47,9.04 IC1.5
N$30  (via drill 0.6)
  Top 0.305: R18.1 v43.03,17.55
  Bottom 0.305: v43.03,17.55 43.61,17.17 44.21,17.17 R20.2 R19.2
RX
  Bottom 0.305: U$1.3_RXD1 35.55,16.44 35.79,16.69 39.22,16.69 39.75,17.35 TX.2
RXO  (via drill 0.6)
  Top 0.305: v26.09,16.33 22.78,16.33 22.48,16.61 15.52,16.61 FTDI.2
  Bottom 0.305: U1.30 20.32,10.7 20.34,13.72 17.68,16.38 14.76,16.38 14.25,16.89 FTDI.2 | RX.1 31.9,16.81 31.42,16.33 v26.09,16.33
SCK
  Bottom 0.305: SPI.1 17.09,2.7 13.41,6.38 13.41,8.17 U1.17
SCL  (via drill 0.6)  (1 unrouted)
  Top 0.305: v14.58,13.79 14.59,13.3 R7.2 13.82,11.57 13.82,8.79 | BMP180.5 14.17,6.6 13.82,6.96 13.82,8.79 | SHT21.6 22.55,8.1 20.6,8.1 18.86,9.84 U1.28 19.28,11.07 19.28,11.38 17.73,12.93 15.16,12.93 R7.2 | v11.94,7.29 12.34,7.29 13.82,8.79
  Bottom 0.305: U1.28 19.36,11.15 19.36,13.06 18.62,13.79 v14.58,13.79 | JP4.1 13.1,5.83 11.94,6.99 v11.94,7.29
SDA  (via drill 0.6)
  Top 0.305: v11.71,13.64 11.68,13.64 11.15,13.11 11.15,12.38 R3.2 | BMP180.6 14.76,4.98 15.21,4.52 15.44,4.52 | 15.44,4.52 18.44,4.52 18.67,4.75 18.67,6.68 19.58,7.59 19.94,7.59 | 19.94,7.59 SHT21.1 15.82,11.94 v15.8,12.12 | JP4.2 15.1,4.18 15.44,4.52 | 19.94,7.59 19.94,7.77
  Bottom 0.305: U1.27 18.87,11.37 18.87,12.8 18.34,13.34 16.15,13.34 15.82,13 15.04,13 | 15.04,13 12.34,13 v11.71,13.64 | v15.8,12.12 15.77,12.27 15.04,13
SS
  Bottom 0.305: SPI.4 23.04,1.17 21.69,2.51 21.41,2.51 20.12,3.81 17.98,3.81 14.91,6.88 14.91,7.41 U1.14
TX
  Bottom 0.305: RX.2 34.44,15.54 U$1.2_TXD1
TX1  (via drill 0.6)
  Top 0.305: v30.73,14.86 33.12,14.86 34.34,16.08 35.36,16.08 TX.1
  Bottom 0.305: IC2.4 25.71,14.18 26.36,14.83 30.72,14.84 v30.73,14.86
TXO
  Bottom 0.305: FTDI.3 17.02,17.83 21.29,13.49 21.44,13.34 21.59,13.34 | 21.59,13.34 21.88,13.36 IC2.2 | U1.31 20.9,10.58 20.9,12.62 21.51,13.23 21.59,13.34
VBATT
  Bottom 0.305: IC1.14 IC1.15 48.26,13.77 48.46,13.57 IC1.16 48.47,12.78 49.23,12.78 50.62,14.17 C11.1 53.89,15.38 54.18,15.37 54.36,15.04 JP2.1
VCC  (via drill 0.6)
  Top 0.305: v7.72,9.7 2.06,9.7 1.65,10.11 1.65,13.03 2.34,13.72 4.83,13.72 6.76,15.65 8.76,15.65 8.87,15.54 v9.32,15.54 9.83,15.54 9.93,15.65 13.74,15.65 13.97,15.52 16.38,15.52 16.66,15.24 v17.4,15.24 v21.26,15.24 21.57,15.24 23.19,13.61 v23.19,10.72 | U$2.VCC v28.04,3.45
  Top 0.406: 34.23,10.67 33.68,10.67 32.92,11.43 31.85,11.43 31.57,11.71 LT3426.5 31.57,11.84 31.14,11.4 25.38,11.4 24.87,11.91 | 34.23,10.67 R9.2 | 34.23,10.67 34.47,10.67 35.53,11.73 35.75,11.73 C7.1 36.21,12.03 C9.1 | D1.C 24.87,11.91 | v23.19,10.72 23.72,10.72 24.87,11.91
  Bottom 0.305: U1.4 20.34,6.2 C3.2 20.37,6.17 19.96,5.77 19.36,5.77 U1.6 18.14,6.99 17.43,6.99 U1.18 14.21,10.21 13.26,10.21 12.75,9.7 v7.72,9.7 R4.2 | IC2.5 23.5,13.05 23.27,13.23 23.27,15.9 22.71,16.41 22.33,16.41 | 22.33,16.41 20.8,16.41 FTDI.4 | v9.32,15.54 LM3480.2 | R5.2 17.05,15.43 v17.4,15.24 | v21.26,15.24 21.26,15.34 22.33,16.41 | v28.04,3.45 28.04,4.56 C4.2 27.27,5.07 24.79,7.54 23.19,9.17 v23.19,10.72
VSOLAR  (via drill 0.6)
  Top 0.305: v47.07,7.37 47.51,7.37 C12.+
  Bottom 0.305: IC1.17 IC1.18 IC1.19 49.26,11.26 49.55,11.56 49.55,12.17 50.88,13.49 51.84,13.49 51.97,13.36 51.97,9.56 R12.2 | R12.2 55.09,8.69 55.42,8.36 55.42,5.87 54.99,5.44 54.27,5.44 JP3.1 | R12.2 51.94,8.67 51.94,7.62 51.69,7.37 v47.07,7.37 46.74,7.37 46.46,7.65 IC1.3 IC1.4 45.96,8.87 45.19,8.1 42.52,8.1 42.19,8.43 42.19,11.58 42.88,12.27 44.45,12.27 IC1.9

### Text on the board
tNames: <3 Swiss
bNames: SBHX TRACKOON / Rev .9